# Altium project ESP12F_infrared.PrjPcb
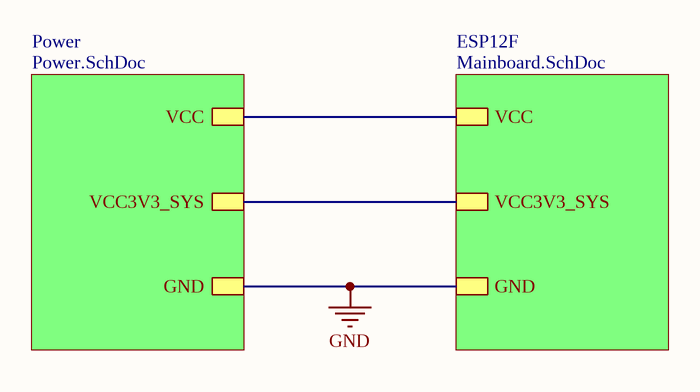
[diagram p0: toplevel.SchDoc]
3 sheets, 34 parts. Net scope: hierarchical (ports join the sheet entries above them; power ports are global).
Board file: Mainboard.PcbDoc
Sheets:
  toplevel.SchDoc
    ESP12F = Mainboard.SchDoc
    Power = Power.SchDoc

## Sheet toplevel.SchDoc
size A4

### Sub-sheets
ESP12F = Mainboard.SchDoc: GND, VCC3V3_SYS, VCC
Power = Power.SchDoc: GND, VCC3V3_SYS, VCC

### Nets
GND: sheet ESP12F/GND, sheet Power/GND
VCC3V3_SYS: sheet ESP12F/VCC3V3_SYS, sheet Power/VCC3V3_SYS
VCC: sheet ESP12F/VCC, sheet Power/VCC

## Sheet Mainboard.SchDoc
size A4
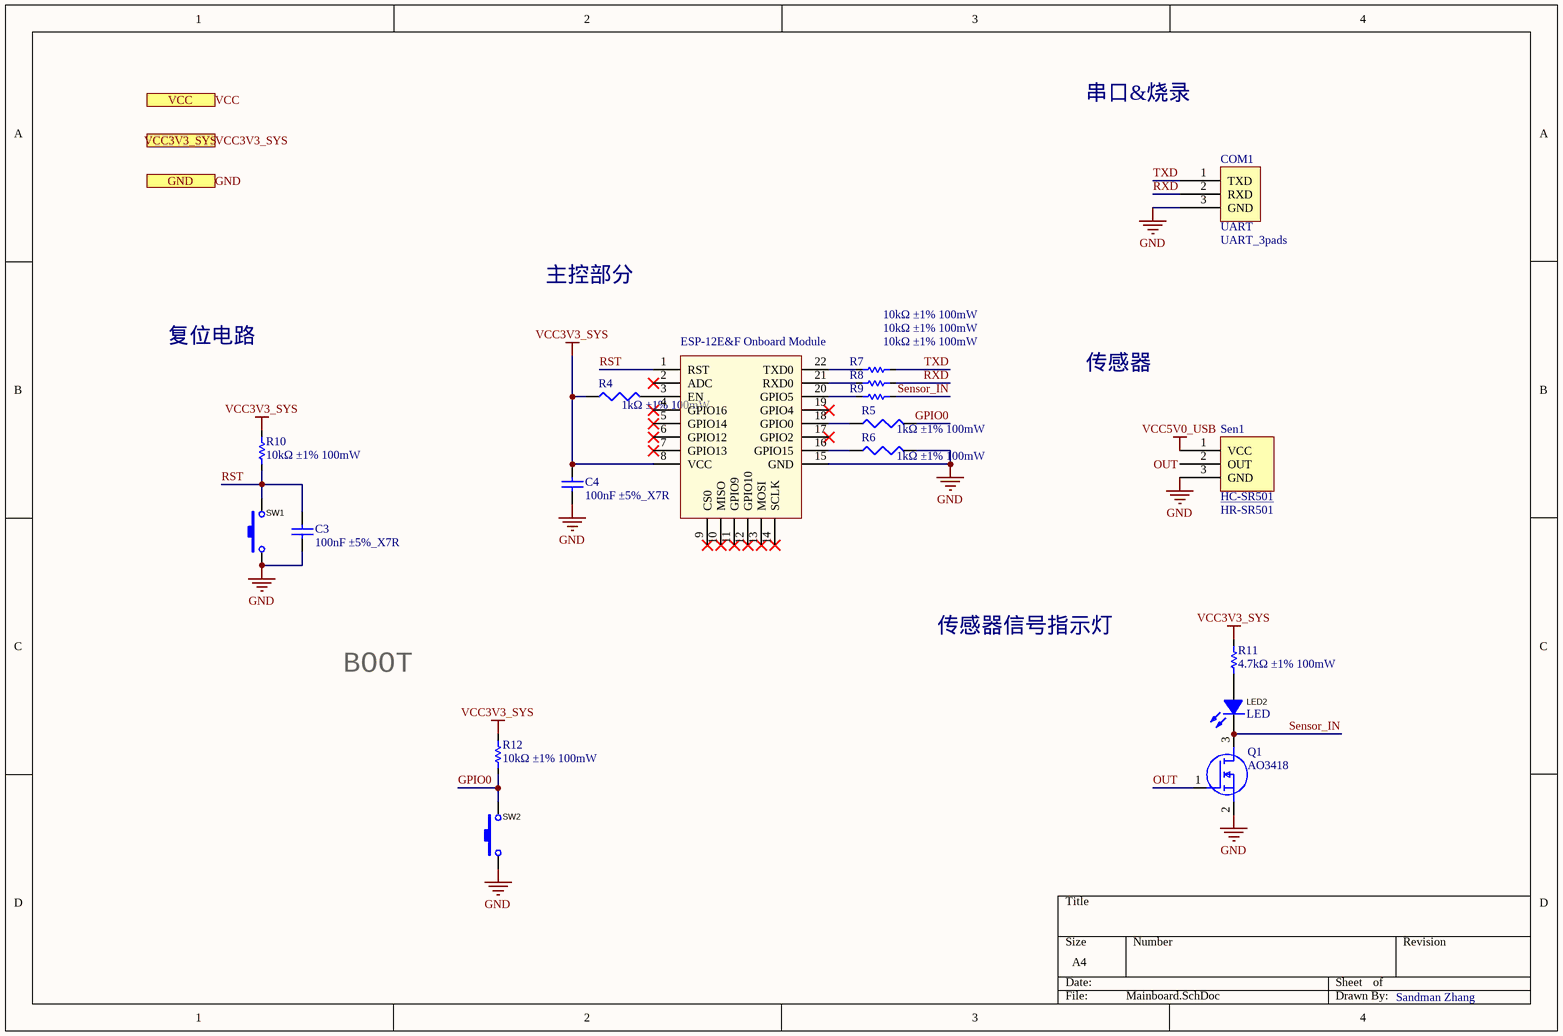
[diagram p1: Mainboard.SchDoc]

### Parts
C3  100nF ±5%_X7R  [C0603]
C4  100nF ±5%_X7R  [C0603]
COM1  UART_3pads  [3pads]
LED2  LED  [LED0603-RD]
Q1  AO3418  [SOT95P280X125-3N]
R4  value 1kΩ ±1% 100mW  [r0402]  (hidden comment: Res3)
R5  value 1kΩ ±1% 100mW  [r0402]  (hidden comment: Res3)
R6  value 1kΩ ±1% 100mW  [r0402]  (hidden comment: Res3)
R7  10kΩ ±1% 100mW  [R0402]
R8  10kΩ ±1% 100mW  [R0402]
R9  10kΩ ±1% 100mW  [R0402]
R10  10kΩ ±1% 100mW  [R0402]
R11  4.7kΩ ±1% 100mW  [R0603]
R12  10kΩ ±1% 100mW  [R0402]
Sen1  HR-SR501  [HR-SR501]
SW1  TS-1185-B-A-B-A  [SW-SMD_L4.0-W3.0-LS5.0]  (value not drawn)
SW2  TS-1185-B-A-B-A  [SW-SMD_L4.0-W3.0-LS5.0]  (value not drawn)
U2  ESP-12E&F Onboard Module  [ESP-12E&F Module]

### Ports
GND, VCC, VCC3V3_SYS

### Nets
GND: C3.1 C4.1 COM1.3(GND) Q1.2(S) R6.2 Sen1.3(GND) SW1.1 SW2.1 U2.15(GND) ; port GND
VCC3V3_SYS: C4.2 R4.1 R10.2 R11.1 R12.2 U2.8(VCC) ; port VCC3V3_SYS
VCC5V0_USB: Sen1.1(VCC)
GPIO0: R5.2 R12.1 SW2.2
OUT: Q1.1(G) Sen1.2(OUT)
RST: C3.2 R10.1 SW1.2 U2.1(RST)
RXD: COM1.2(RXD) R8.1
Sensor_IN: LED2.2(K) Q1.3(D) R9.1
TXD: COM1.1(TXD) R7.1
NetLED2_1: LED2.1(A) R11.2
NetR4_2: R4.2 U2.3(EN)
NetR5_1: R5.1 U2.18(GPIO0)
NetR6_1: R6.1 U2.16(GPIO15)
NetR7_2: R7.2 U2.22(TXD0)
NetR8_2: R8.2 U2.21(RXD0)
NetR9_2: R9.2 U2.20(GPIO5)

Not connected (* = marked no-connect by the designer): U2 2(ADC)* 4(GPIO16)* 5(GPIO14)* 6(GPIO12)* 7(GPIO13)* 9(CS0)* 10(MISO)* 11(GPIO9)* 12(GPIO10)* 13(MOSI)* 14(SCLK)* 17(GPIO2)* 19(GPIO4)*

### Notes on the sheet
- 串口&烧录
- 主控部分
- 复位电路
- 传感器
- 传感器信号指示灯
- BOOT
- Sandman Zhang
- (in symbol HR-SR501) HC-SR501
- (in symbol UART_3pads) UART

### Library data of the parts
C3 C4 = Cap: Capacitor; Published: 8-Jun-2000; LatestRevisionDate: 17-Jul-2002; LatestRevisionNote: Re-released for DXP Platform.; PackageReference: RAD-0.3; Publisher: Altium Limited; PackageDescription: Radial Cap, Thru-Hole; 2 Leads; 0.3 in Pin Spacing
LED2 = LED: 发光颜色:; Manufacturer: EVERLIGHT(亿光); Name: 17-21SURC/S530-A2/TR8; Add into BOM: yes; Emitted Color: 红灯; Symbol: 17-21SURC/S530-A2/TR8; Device: 17-21SURC/S530-A2/TR8; LCSC Part Name: 红灯; Supplier Part: C131244; Manufacturer Part: 17-21SURC/S530-A2/TR8; Supplier Footprint: 0805; JLCPCB Part Class: Extended Part; Datasheet: https://atta.szlcsc.com/upload/public/pdf/source/20170918/C131244_1505726880590976254.pdf; Supplier: LCSC; Convert to PCB: yes
Q1 = AO3418: MOSFET (N-Channel); Manufacturer_Name: Alpha & Omega Semiconductors; Datasheet Link: http://www.aosmd.com/res/data_sheets/AO3418.pdf; Height: 1.25mm; Manufacturer_Part_Number: AO3418; Arrow Part Number: AO3418; Arrow Price/Stock: https://www.arrow.com/en/products/ao3418/alpha-and-omega-semiconductor
R4-R6 = Res3: Resistor; Published: 8-Jun-2000; LatestRevisionDate: 29-May-2009; LatestRevisionNote: IPC-7351 Footprint Added.; PackageReference: J1-0603; Publisher: Altium Limited; PackageDescription: Chip Resistor
R7-R12 = Res: Resistor; Published: 8-Jun-2000; LatestRevisionDate: 17-Jul-2002; LatestRevisionNote: Re-released for DXP Platform.; PackageReference: AXIAL-0.3; Publisher: Altium Limited; PackageDescription: Axial Device, Thru-Hole; 2 Leads; 0.3 in Pin Spacing
Sen1 = HR-SR501: 人体红外感应模块
SW1 SW2 = Button: 触点电流：50mA 额定电压(DC)：12V 电路结构：单刀单掷 安装方式：立贴 带灯：无 作用力：160gf 机械寿命：10万次 带支架：否 轻触开关3x4x2贴片2脚小龟 160gf; Manufacturer: XKB Connectivity(中国星坤); Add into BOM: yes; Contact Current: 50mA; Voltage Rating (DC): 12V; Circuit: 单刀单掷; Actuator Style: 圆形按钮; Actuator/Cap Color: 黑色; With Lamp: 无; Mechanical Life: 10万次; Switch Length: 4mm; Switch Width: 3mm; Switch Height: 2mm; Strike Gundam: 否; Name: TS-1185-B-A-B-A; Symbol: TS-1185-B-A-B-A; Device: TS-1185-B-A-B-A; LCSC Part Name: 4*3*2mm 立贴 轻触开关; Supplier Part: C561517; Manufacturer Part: TS-1185-B-A-B-A; Supplier Footprint: SMD; JLCPCB Part Class: Extended Part; Datasheet: https://atta.szlcsc.com/upload/public/pdf/source/20211011/C2F26DC0AE1820400F54DBF49644F5A1.pdf; Supplier: LCSC; Convert to PCB: yes; Insulation Resistance: -; Mounting Style: 立贴; Operating Force: 160gf; Operating Temperature: -30℃~+85℃

## Sheet Power.SchDoc
size A4
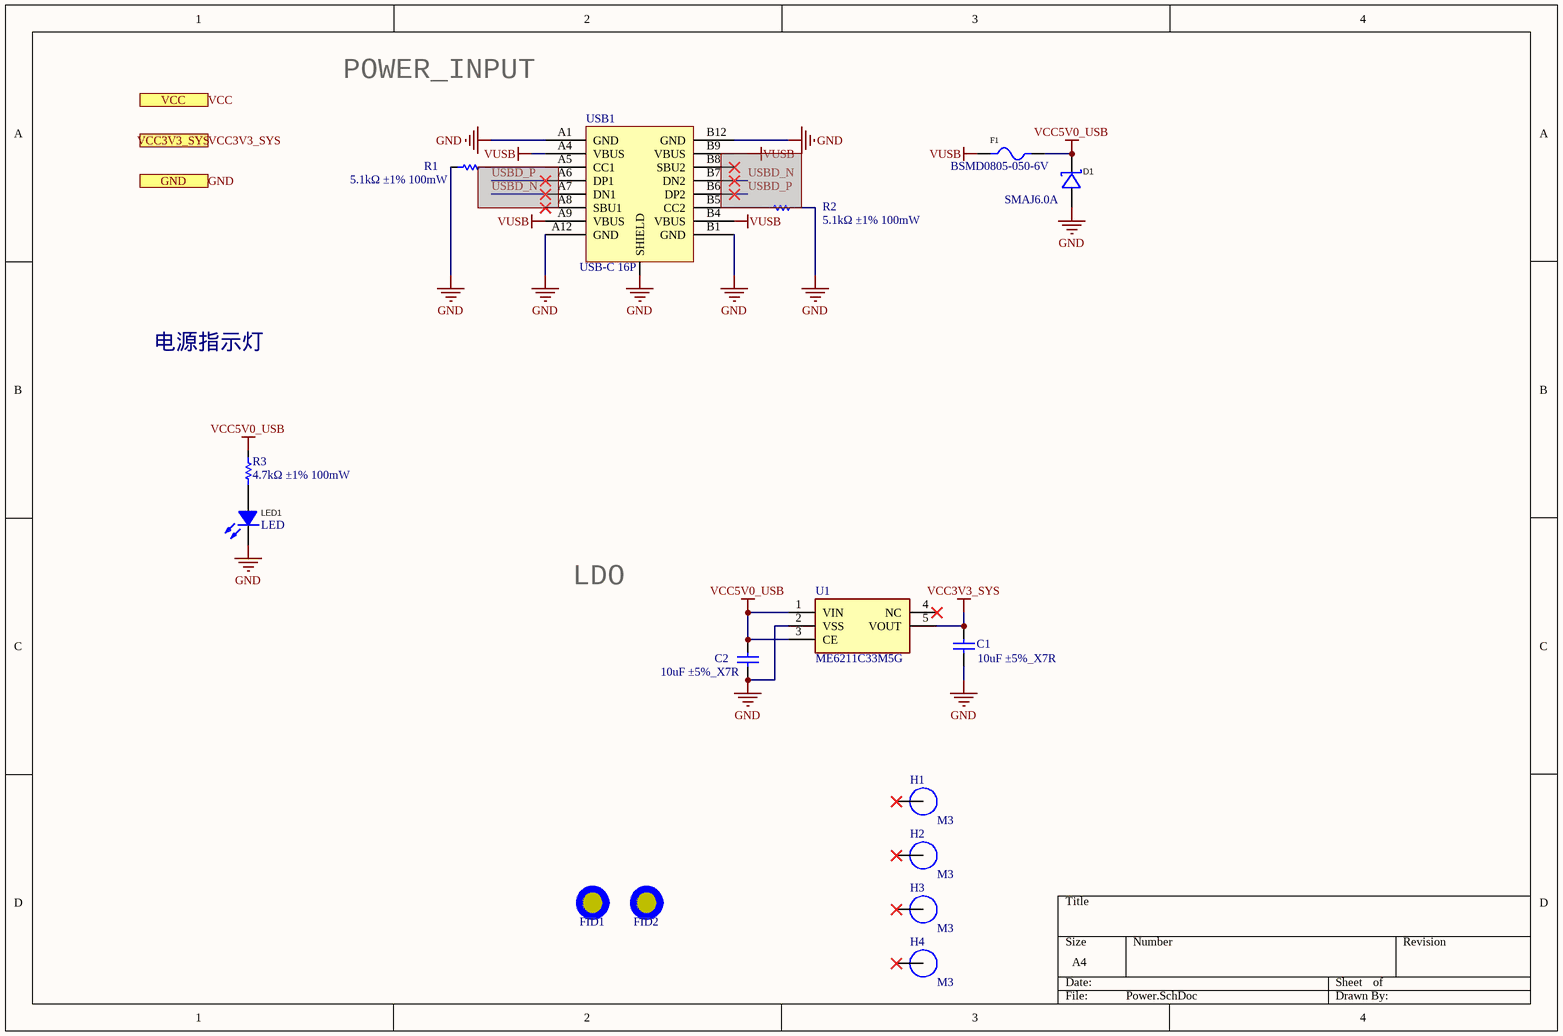
[diagram p2: Power.SchDoc]

### Parts
C1  10uF ±5%_X7R  [C0603]
C2  10uF ±5%_X7R  [C0603]
D1  SMAJ6.0A  [SMA_L4.4-W2.6-LS5.0-RD]
F1  BSMD0805-050-6V  [F0805]
FID1  MARK Point  [FIDUCIAL]  (value not drawn)
FID2  MARK Point  [FIDUCIAL]  (value not drawn)
H1  M3  [M3_PTH]
H2  M3  [M3_PTH]
H3  M3  [M3_PTH]
H4  M3  [M3_PTH]
LED1  LED  [LED0603-RD]
R1  5.1kΩ ±1% 100mW  [R0402]
R2  5.1kΩ ±1% 100mW  [R0402]  (masked out: inside a compile mask, not in the netlist)
R3  4.7kΩ ±1% 100mW  [R0603]
U1  ME6211C33M5G  [SOT95P282X145-5N]
USB1  USB-C 16P  [USB-C-16P]

### Ports
GND, VCC, VCC3V3_SYS

### Nets
GND: C1.1 C2.1 D1.2(A) LED1.2(K) R1.1 U1.2(VSS) USB1.0(SHIELD) USB1.A1(GND) USB1.A12(GND) USB1.B1(GND) USB1.B12(GND) ; port GND
VCC3V3_SYS: C1.2 U1.5(VOUT) ; port VCC3V3_SYS
VCC5V0_USB: C2.2 D1.1(K) F1.2 R3.1 U1.1(VIN) U1.3(CE)
VUSB: F1.1 USB1.A4(VBUS) USB1.A9(VBUS) USB1.B4(VBUS)
NetLED1_1: LED1.1(A) R3.2

Not connected (* = marked no-connect by the designer): H1 1*; H2 1*; H3 1*; H4 1*; R1 2; U1 4(NC)*; USB1 A5(CC1) A6(DP1)* A7(DN1)* A8(SBU1)* B5(CC2) B6(DP2)* B7(DN2)* B8(SBU2)* B9(VBUS)

### Notes on the sheet
- POWER_INPUT
- 电源指示灯
- LDO

### Library data of the parts
C1 C2 = Cap: Capacitor; Published: 8-Jun-2000; LatestRevisionDate: 17-Jul-2002; LatestRevisionNote: Re-released for DXP Platform.; PackageReference: RAD-0.3; Publisher: Altium Limited; PackageDescription: Radial Cap, Thru-Hole; 2 Leads; 0.3 in Pin Spacing
D1 = SMAJ6.0A_C152112: Manufacturer: BORN(伯恩半导体); Add into BOM: yes; Polarity: 单向; Reverse Stand-Off Voltage (Vrwm): 6V; Breakdown Voltage: 6.67V; Peak Pulse Current (Ipp)@10/1000μs: 38.8A; Maximum Clamping Voltage: 10.3V; Name: SMAJ6.0A; Symbol: SMAJ6.0A_C152112; Device: SMAJ6.0A_C152112; LCSC Part Name: 单向 Vrwm:6V; Supplier Part: C152112; Manufacturer Part: SMAJ6.0A; Supplier Footprint: SMA(DO-214AC); JLCPCB Part Class: Extended Part; Datasheet: https://atta.szlcsc.com/upload/public/pdf/source/20180207/C152112_15179949389561359152.pdf; Supplier: LCSC; Convert to PCB: yes
F1 = BSMD0805-050-6V: Manufacturer: BHFUSE(佰宏); Add into BOM: yes; Operating Voltage (Max): 6V; Current Rating (Max): 40A; Hold Current: 500mA; Trip Current: 1A; Power Dissipation: 500mW; Resistance - Initial (Ri) (Min): 100mΩ; Resistance - Post Trip (R1) (Max): 850mΩ; Maximum Time to Trip: 100ms; Name: BSMD0805-050-6V; Symbol: BSMD0805-050-6V; Device: BSMD0805-050-6V; LCSC Part Name: 6V 500mA 0805自恢复; Supplier Part: C883108; Manufacturer Part: BSMD0805-050-6V; Supplier Footprint: 0805; JLCPCB Part Class: Extended Part; Datasheet: https://atta.szlcsc.com/upload/public/pdf/source/20220223/3FD8E8A8A3681642EAEF465E16495357.pdf; Supplier: LCSC; Convert to PCB: yes; Operating Temperature: -40℃~+85℃
FID1 FID2 = FIDUCIAL: 1mm Fiducial with 2mm soldermask, 3mm keepout
H1-H4 = PTH: Hole with copper
LED1 = LED: as LED2 on sheet Mainboard; Symbol: 17-21SURC/S530-A2/TR8; Device: 17-21SURC/S530-A2/TR8; LCSC Part Name: 红灯; Supplier Part: C131244; Manufacturer Part: 17-21SURC/S530-A2/TR8; Supplier Footprint: 0805; JLCPCB Part Class: Extended Part; Datasheet: https://atta.szlcsc.com/upload/public/pdf/source/20170918/C131244_1505726880590976254.pdf; Supplier: LCSC; Convert to PCB: yes
R1-R3 = Res: Resistor; Published: 8-Jun-2000; LatestRevisionDate: 17-Jul-2002; LatestRevisionNote: Re-released for DXP Platform.; PackageReference: AXIAL-0.3; Publisher: Altium Limited; PackageDescription: Axial Device, Thru-Hole; 2 Leads; 0.3 in Pin Spacing
U1 = ME6211C33M5G: Integrated Circuit; Manufacturer_Name: Microne; Height: 1.45mm; Manufacturer_Part_Number: ME6211C33M5G

## Nets that join several sheets
GND: Mainboard (9 pins), Power (11 pins)
VCC3V3_SYS: Mainboard (6 pins), Power (C1.2 U1.5)
VCC5V0_USB: Mainboard (Sen1.1), Power (6 pins)